# Altium project yoctobob.PrjPcb
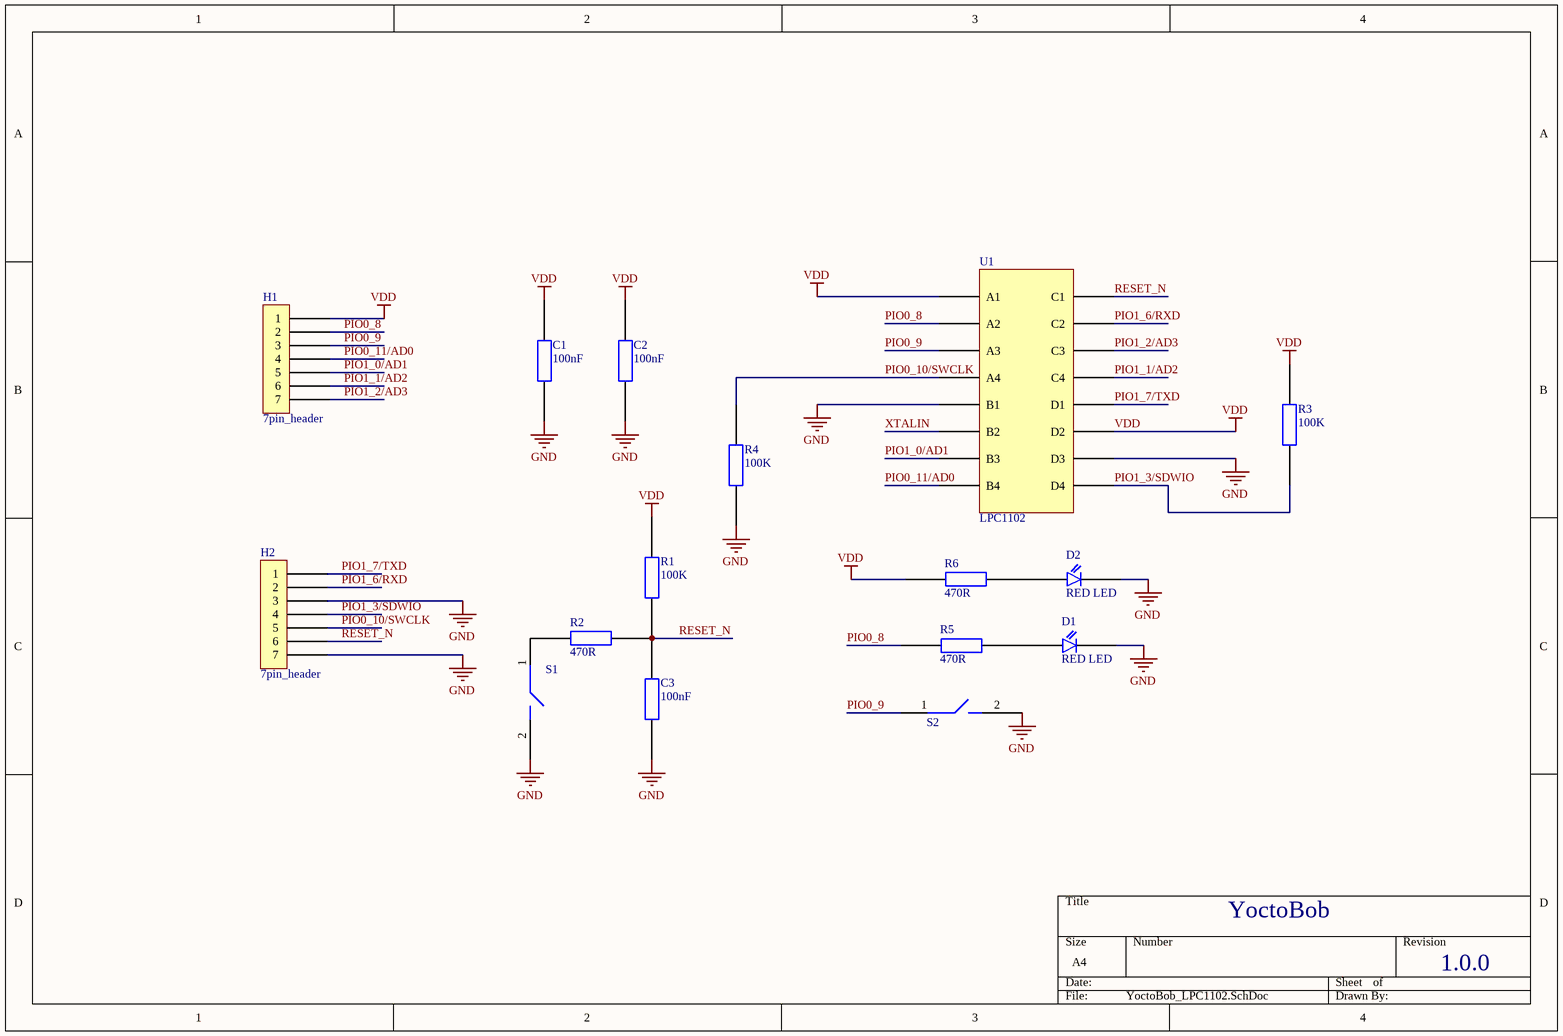
[diagram p0: YoctoBob_LPC1102.SchDoc]
1 sheet, 16 parts. Net scope: global (net labels, ports and power ports of the same name join across sheets).
Board file: YoctoBob_pcb_r1.0.0.PcbDoc

## Sheet YoctoBob_LPC1102.SchDoc
size A4

### Parts
C1  100nF  [C0805]
C2  100nF  [C0805]
C3  100nF  [C0805]
D1  RED LED  [RED_LED_0805]
D2  RED LED  [RED_LED_0805]
H1  7pin_header  [HDR1X7]
H2  7pin_header  [HDR1X7]
R1  100K  [R0805]
R2  470R  [R0805]
R3  100K  [R0805]
R4  100K  [R0805]
R5  470R  [R0805]
R6  470R  [R0805]
S1  switch  [SWITCH_B3U-1000P]  (value not drawn)
S2  switch  [SWITCH_B3U-1000P]  (value not drawn)
U1  LPC1102

### Nets
GND: C1.1 C2.1 C3.1 D1.2 D2.2 H2.3 H2.7 R4.2 S1.2 S2.2 U1.B1 U1.D3
VDD: C1.2 C2.2 H1.1 R1.2 R3.1 R6.1 U1.A1 U1.D2
PIO0_8: H1.2 R5.1 U1.A2
PIO0_9: H1.3 S2.1 U1.A3
PIO0_10/SWCLK: H2.5 R4.1 U1.A4
PIO0_11/AD0: H1.4 U1.B4
PIO1_0/AD1: H1.5 U1.B3
PIO1_1/AD2: H1.6 U1.C4
PIO1_2/AD3: H1.7 U1.C3
PIO1_3/SDWIO: H2.4 R3.2 U1.D4
PIO1_6/RXD: H2.2 U1.C2
PIO1_7/TXD: H2.1 U1.D1
RESET_N: C3.2 H2.6 R1.1 R2.2 U1.C1
XTALIN: U1.B2
NetD1_1: D1.1 R5.2
NetD2_1: D2.1 R6.2
NetR2_1: R2.1 S1.1

### Notes on the sheet
- YoctoBob
- 1.0.0

### Library data of the parts
C1-C3 = 100nF: Supplier 1: Digi-Key; Supplier Part Number 1: 399-1167-1-ND
D1 D2 = RED LED: Supplier 1: Digi-Key; Supplier Part Number 1: 160-1427-1-ND
H1 H2 = 7pin_header: Supplier 1: Digi-Key; Supplier Part Number 1: A31117-ND
R1 R3 R4 = 100K: Supplier 1: Digi-Key; Supplier Part Number 1: P100KADKR-ND
R2 R5 R6 = 470R: Supplier 1: Digi-Key; Supplier Part Number 1: RMCF0805JG470RCT-ND
S1 S2 = switch: Supplier 1: Digi-Key; Supplier Part Number 1: SW1021DKR-ND
U1 = LPC1102: Supplier 1: Digi-Key; Supplier Part Number 1: 568-5141-1-ND